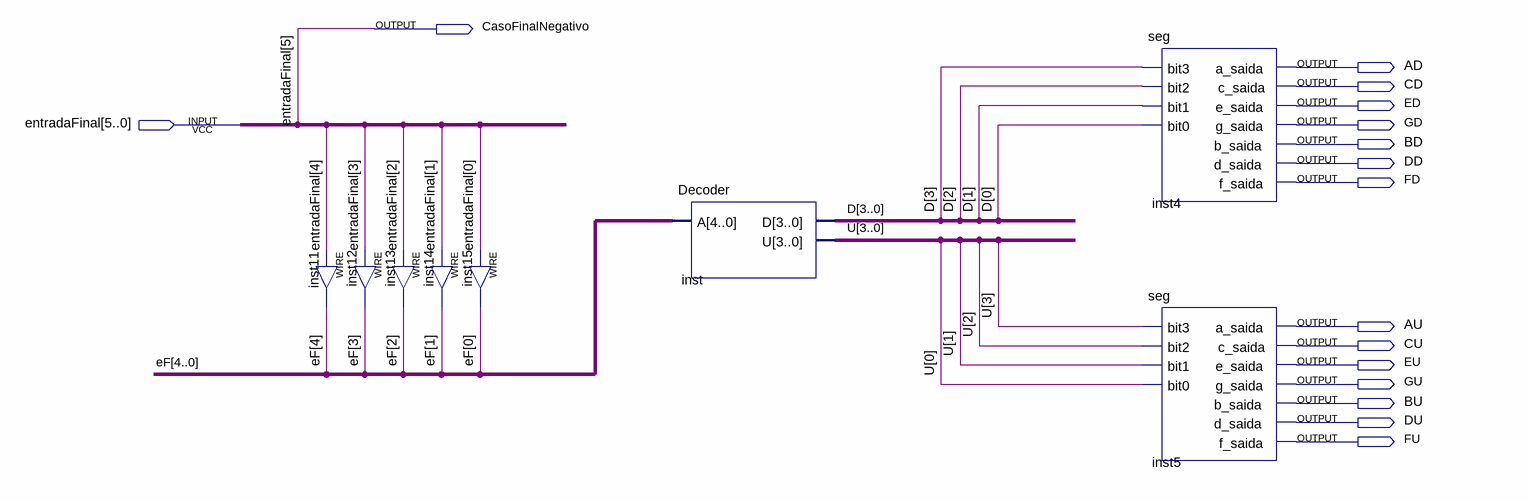
[diagram p0: schematic sheet]
// Quartus schematic saidaFinal.bdf as structural Verilog: 8 symbols, 16 pins
module saidaFinal (
  input  [5:0] entradaFinal,
  output CasoFinalNegativo,
  output AD,
  output CD,
  output ED,
  output GD,
  output BD,
  output DD,
  output FD,
  output AU,
  output CU,
  output EU,
  output GU,
  output BU,
  output DU,
  output FU
);

  wire [3:0] D, U;
  wire [4:0] eF;

  assign eF[4] = entradaFinal[4];  // WIRE inst11
  assign eF[3] = entradaFinal[3];  // WIRE inst12
  assign eF[2] = entradaFinal[2];  // WIRE inst13
  assign eF[1] = entradaFinal[1];  // WIRE inst14
  assign eF[0] = entradaFinal[0];  // WIRE inst15
  Decoder inst (.A(eF), .D(D), .U(U));
  seg inst4 (
    .bit3(D[3]), .bit2(D[2]), .bit1(D[1]), .bit0(D[0]), .a_saida(AD), .c_saida(CD), .e_saida(ED),
    .g_saida(GD), .b_saida(BD), .d_saida(DD), .f_saida(FD));
  seg inst5 (
    .bit3(U[3]), .bit2(U[2]), .bit1(U[1]), .bit0(U[0]), .a_saida(AU), .c_saida(CU), .e_saida(EU),
    .g_saida(GU), .b_saida(BU), .d_saida(DU), .f_saida(FU));

  assign CasoFinalNegativo = entradaFinal[5];
endmodule
